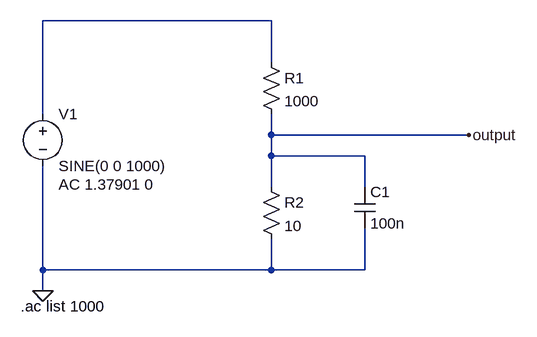
[diagram p0: schematic lcr-test-ltspice.asc]
lcr-test-ltspice.asc, the LTspice schematic file:
Version 4
SHEET 1 880 680
WIRE 368 -16 16 -16
WIRE 368 48 368 -16
WIRE 16 128 16 -16
WIRE 368 160 368 128
WIRE 672 160 368 160
WIRE 368 192 368 160
WIRE 512 192 368 192
WIRE 368 240 368 192
WIRE 512 240 512 192
WIRE 16 368 16 208
WIRE 368 368 368 320
WIRE 368 368 16 368
WIRE 512 368 512 304
WIRE 512 368 368 368
WIRE 16 400 16 368
FLAG 16 400 0
FLAG 672 160 output
SYMBOL voltage 16 112 R0
WINDOW 123 24 124 Left 2
WINDOW 39 0 0 Left 0
SYMATTR InstName V1
SYMATTR Value SINE(0 0 1000)
SYMATTR Value2 AC 1.37901 0
SYMBOL res 352 32 R0
SYMATTR InstName R1
SYMATTR Value 1000
SYMBOL res 352 224 R0
SYMATTR InstName R2
SYMATTR Value 10
SYMBOL cap 496 240 R0
SYMATTR InstName C1
SYMATTR Value 100n
TEXT -18 424 Left 2 !.ac list 1000

The netlist it stands for:
* lcr-test-ltspice.asc
V1 N001 0 SINE(0 0 1000) AC 1.37901 0
R1 N001 output 1000
R2 output 0 10
C1 output 0 100n
.ac list 1000
.backanno
.end